# Altium project PCB_Project_MOPA_D.PrjPcb (part 2 of 2)

## Sheet [7] ADC_Acquisition.SchDoc: =DocumentName
size A3; Organization: ORGANIZATION; Address1: R. Aprígio Veloso, 882, Universitário; Address2: Campina Grande - PB; Address3: 58429-900; DocumentNumber: 7; Revision: -; SheetNumber: 7; SheetTotal: 8; Project: PCB_Project_MOPA_D.PrjPcb; ENG_DATE: --/--/--; DSN_DATE: --/--/--; CHK_DATE: --/--/--; SCH_SCALE: 1:1
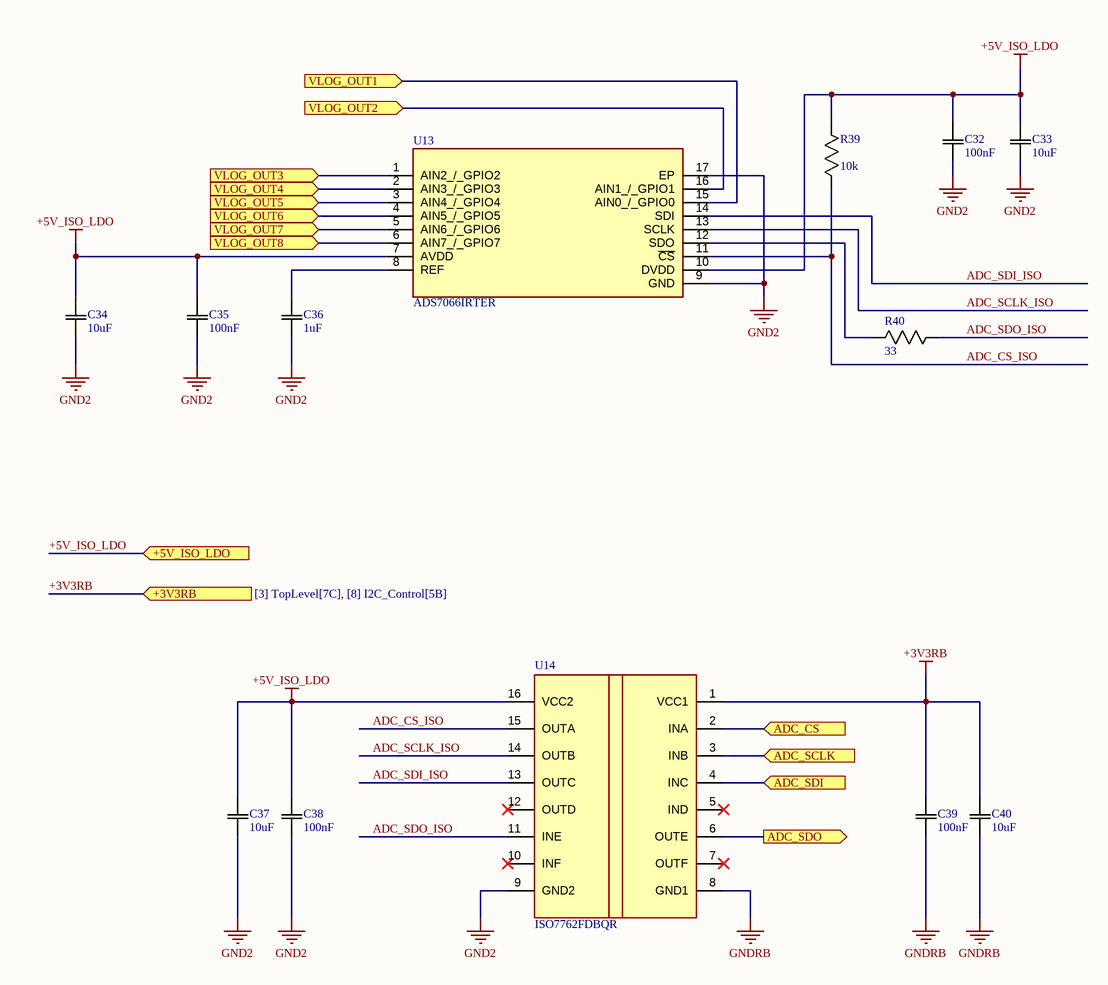
[diagram p7: [7] ADC_Acquisition.SchDoc]

### Parts
C32  value 100nF  [CAPC1005X40N]  (hidden comment: GCM155R71H104KE02D)
C33  value 10uF  [CAPC1005X40N]  (hidden comment: GRT155R61A106ME13D)
C34  value 10uF  [CAPC1005X40N]  (hidden comment: GRT155R61A106ME13D)
C35  value 100nF  [CAPC1005X40N]  (hidden comment: GCM155R71H104KE02D)
C36  value 1uF  [CAPC1005X40N]  (hidden comment: GRM155Z71A105KE01D)
C37  value 10uF  [CAPC1005X40N]  (hidden comment: GRT155R61A106ME13D)
C38  value 100nF  [CAPC1005X40N]  (hidden comment: GCM155R71H104KE02D)
C39  value 100nF  [CAPC1005X40N]  (hidden comment: GCM155R71H104KE02D)
C40  value 10uF  [CAPC1005X40N]  (hidden comment: GRT155R61A106ME13D)
R39  value 10k  [RESC1005X40N]  (hidden comment: RC0402FR-0710KL)
R40  value 33  [RESC1005X40N]  (hidden comment: RC0402FR-0733RL)
U13  ADS7066IRTER  [QFN50P300X300X80-17N-D]
U14  ISO7762FDBQR  [SOP64P600X175-16N]

### Ports
+3V3RB (in, see [3] TopLevel[7C], [8] I2C_Control[5B]), +5V_ISO_LDO (in, see [3] TopLevel[7B], [4] PowerManagement[7B]), ADC_CS (in, see [3] TopLevel[7C]), ADC_SCLK (in, see [3] TopLevel[7C]), ADC_SDI (in, see [3] TopLevel[7C]), ADC_SDO (out, see [3] TopLevel[7C]), VLOG_OUT1 (in, see [3] TopLevel[7B], [5] AnalogChannels_1_2_3_4[4A]), VLOG_OUT2 (in, see [3] TopLevel[7B], [5] AnalogChannels_1_2_3_4[8A]), VLOG_OUT3 (in, see [3] TopLevel[7B], [5] AnalogChannels_1_2_3_4[4C]), VLOG_OUT4 (in, see [3] TopLevel[7B], [5] AnalogChannels_1_2_3_4[8C]), VLOG_OUT5 (in, see [3] TopLevel[7C], [6] AnalogChannels_5_6_7_8[4A]), VLOG_OUT6 (in, see [3] TopLevel[7C], [6] AnalogChannels_5_6_7_8[8A]), VLOG_OUT7 (in, see [3] TopLevel[7C], [6] AnalogChannels_5_6_7_8[4C]), VLOG_OUT8 (in, see [3] TopLevel[7C], [6] AnalogChannels_5_6_7_8[8C])

### Nets
+3V3RB: C39.2 C40.2 U14.1(VCC1) ; port +3V3RB
+5V_ISO_LDO: C32.2 C33.2 C34.2 C35.2 C37.2 C38.2 R39.1 U13.7(AVDD) U13.10(DVDD) U14.16(VCC2) ; port +5V_ISO_LDO
GND2: C32.1 C33.1 C34.1 C35.1 C36.1 C37.1 C38.1 U13.9(GND) U13.17(EP) U14.9(GND2)
GNDRB: C39.1 C40.1 U14.8(GND1)
ADC_CS: U14.2(INA) ; port ADC_CS
ADC_CS_ISO: R39.2 U13.11(~{CS}) U14.15(OUTA)
ADC_SCLK: U14.3(INB) ; port ADC_SCLK
ADC_SCLK_ISO: U13.13(SCLK) U14.14(OUTB)
ADC_SDI: U14.4(INC) ; port ADC_SDI
ADC_SDI_ISO: U13.14(SDI) U14.13(OUTC)
ADC_SDO: U14.6(OUTE) ; port ADC_SDO
ADC_SDO_ISO: R40.1 U14.11(INE)
VLOG_OUT1: U13.15(AIN0_/_GPIO0) ; port VLOG_OUT1
VLOG_OUT2: U13.16(AIN1_/_GPIO1) ; port VLOG_OUT2
VLOG_OUT3: U13.1(AIN2_/_GPIO2) ; port VLOG_OUT3
VLOG_OUT4: U13.2(AIN3_/_GPIO3) ; port VLOG_OUT4
VLOG_OUT5: U13.3(AIN4_/_GPIO4) ; port VLOG_OUT5
VLOG_OUT6: U13.4(AIN5_/_GPIO5) ; port VLOG_OUT6
VLOG_OUT7: U13.5(AIN6_/_GPIO6) ; port VLOG_OUT7
VLOG_OUT8: U13.6(AIN7_/_GPIO7) ; port VLOG_OUT8
NetC36_2: C36.2 U13.8(REF)
NetR40_2: R40.2 U13.12(SDO)

Not connected (* = marked no-connect by the designer): U14 5(IND)* 7(OUTF)* 10(INF)* 12(OUTD)*

### Notes on the sheet
- REVISION
- DESCRIPTION
- DATE
- APPROVED
- ADDRESS
- PROJECT
- VERSION
- TITLE
- A3
- SIZE
- SCALE
- DOCUMENT NAME:
- DOCUMENT REVISION:
- OF
- SHEET:
- PROJECT REVISION:

### Library data of the parts
C32 C35 C38 C39 = GCM155R71H104KE02D: 0.1 µF ±10% 50V Ceramic Capacitor X7R 0402 (1005 Metric); Manufacturer_Name: Murata; Copyright: Copyright (C) 2026 Ultra Librarian. All rights reserved.; Manufacturer_Part_Number: GCM155R71H104KE02D; Supplier 1: DigiKey; Supplier Part Number 1: 490-10672-1-ND; Datasheet Link: https://search.murata.co.jp/Ceramy/image/img/A01X/G101/ENG/GCM155R71H104KE02-01.pdf
C33 C34 C37 C40 = GRT155R61A106ME13D: 10 µF ±20% 10V Ceramic Capacitor X5R 0402 (1005 Metric); Manufacturer_Name: Murata; Copyright: Copyright (C) 2026 Ultra Librarian. All rights reserved.; Manufacturer_Part_Number: GRT155R61A106ME13D; Supplier 1: DigiKey; Supplier Part Number 1: 490-GRT155R61A106ME13DCT-ND; Datasheet Link: https://search.murata.co.jp/Ceramy/image/img/A01X/G101/ENG/GRT155R61A106ME13-01A.pdf
C36 = GRM155Z71A105KE01D: 1 µF ±10% 10V Ceramic Capacitor X7R 0402 (1005 Metric); Manufacturer_Name: Murata; Copyright: Copyright (C) 2025 Ultra Librarian. All rights reserved.; Manufacturer_Part_Number: GRM155Z71A105KE01D; Supplier 1: DigiKey; Supplier Part Number 1: 490-GRM155Z71A105KE01DCT-ND
R39 = RC0402FR-0710KL: 10 kOhms ±1% 0.063W, 1/16W Chip Resistor 0402 (1005 Metric) Moisture Resistant Thick Film; Manufacturer_Name: Yageo; Copyright: Copyright (C) 2025 Ultra Librarian. All rights reserved.; Manufacturer_Part_Number: RC0402FR-0710KL; Supplier: Digikey; Supplier 1: DigiKey; Supplier Part Number 1: 311-10.0KLRCT-ND; Datasheet Link: https://yageogroup.com/content/datasheet/asset/file/PYU-RC_GROUP_51_ROHS_L
R40 = RC0402FR-0733RL: 33 Ohms ±1% 0.063W, 1/16W Chip Resistor 0402 (1005 Metric) Moisture Resistant Thick Film; Manufacturer_Name: Yageo; Copyright: Copyright (C) 2025 Ultra Librarian. All rights reserved.; Manufacturer_Part_Number: RC0402FR-0733RL; Supplier 1: DigiKey; Supplier Part Number 1: 311-33.0LRCT-ND; Datasheet Link: https://yageogroup.com/content/datasheet/asset/file/PYU-RC_GROUP_51_ROHS_L
U13 = ADS7066IRTER: Analog to Digital Converters - ADC Eight-channel, 250-kSPS, 16-bit analog-to-digital converter with internal reference, GPIOs and SPI 16-WQFN -40 to 125; Manufacturer_Name: Texas Instruments; Geometry.Height: 0.8mm; Manufacturer_Part_Number: ADS7066IRTER; Mouser Part Number: 595-ADS7066IRTER; Mouser Price/Stock: https://www.mouser.co.uk/ProductDetail/Texas-Instruments/ADS7066IRTER?qs=ST9lo4GX8V1NXvZuWWBhPA%3D%3D; Arrow Part Number: ADS7066IRTER; Arrow Price/Stock: https://www.arrow.com/en/products/ads7066irter/texas-instruments.html?utm_currency=USD&region=nac; Datasheet Link: https://www.ti.com/lit/ds/symlink/ads7066.pdf?ts=1708383444470&ref_url=https%253A%252F%252Fwww.ti.com%252Fproduct%252FADS7066%253Futm_source%253Dgoogle%2526utm_medium%253Dcpc%2526utm_campaign%253Dasc-null-null-GPN_EN-cpc-pf-google-wwe%2526utm_content%253D; Supplier 1: Digikey; Supplier Part Number 1: 296-ADS7066IRTERCT-ND; Value: ADS7066IRTER
U14 = ISO7762FDBQR: General Purpose Digital Isolator 3000Vrms 6 Channel 100Mbps 85kV/µs CMTI 16-SSOP (0.154", 3.90mm Width); Manufacturer_Name: Texas Instruments; TYPE: TYPE; RefDes: RefDes; Copyright: Copyright (C) 2025 Ultra Librarian. All rights reserved.; Manufacturer_Part_Number: ISO7762FDBQR; Supplier 1: DigiKey; Supplier Part Number 1: 296-49452-1-ND; Value: ISO7762FDBQR; Datasheet Link: https://www.ti.com/lit/ds/symlink/iso7760.pdf?ts=1712058534565&ref_url=https%253A%252F%252Fwww.ti.com%252Fsitesearch%252Fen-us%252Fdocs%252Funiversalsearch.tsp%253FlangPref%253Den-US%2526searchTerm%253DISO7760DBQR%2526nr%253D9

## Nets that join several sheets
+3V3_ISO: [5] AnalogChannels_1_2_3_4 (8 pins), [6] AnalogChannels_5_6_7_8 (8 pins), [4] PowerManagement (C14.2 R5.1 U4.5), [8] I2C_Control (9 pins)
+3V3RB: [3] TopLevel (CN2.1 CN2.17), [8] I2C_Control (5 pins), [7] ADC_Acquisition (C39.2 C40.2 U14.1)
+5V_ISO: [5] AnalogChannels_1_2_3_4 (L1.1 L2.1 L3.1 L4.1), [6] AnalogChannels_5_6_7_8 (L5.1 L6.1 L7.1 L8.1), [4] PowerManagement (9 pins)
+5V_ISO_LDO: [4] PowerManagement (C12.2 C13.2 U3.1 U3.2), [7] ADC_Acquisition (10 pins)
GND2: [5] AnalogChannels_1_2_3_4 (24 pins), [6] AnalogChannels_5_6_7_8 (24 pins), [4] PowerManagement (15 pins), [8] I2C_Control (9 pins), [7] ADC_Acquisition (10 pins)
GNDRB: [3] TopLevel (8 pins), [8] I2C_Control (C44.1 C45.1 U16.5), [7] ADC_Acquisition (C39.1 C40.1 U14.8)
ADC_CS: [3] TopLevel (CN2.24), [7] ADC_Acquisition (U14.2)
ADC_SCLK: [3] TopLevel (R47.2), [7] ADC_Acquisition (U14.3)
ADC_SDI: [3] TopLevel (R46.2), [7] ADC_Acquisition (U14.4)
ADC_SDO: [3] TopLevel (CN2.21), [7] ADC_Acquisition (U14.6)
NetR7_2: [5] AnalogChannels_1_2_3_4 (R7.2 U5.6), [8] I2C_Control (U15.7)
NetR8_2: [5] AnalogChannels_1_2_3_4 (R8.2 U5.5), [8] I2C_Control (U15.6)
NetR9_2: [5] AnalogChannels_1_2_3_4 (R9.2 U6.6), [8] I2C_Control (U15.5)
NetR10_2: [5] AnalogChannels_1_2_3_4 (R10.2 U6.5), [8] I2C_Control (U15.4)
NetR15_2: [5] AnalogChannels_1_2_3_4 (R15.2 U7.6), [8] I2C_Control (U15.11)
NetR16_2: [5] AnalogChannels_1_2_3_4 (R16.2 U7.5), [8] I2C_Control (U15.10)
NetR17_2: [5] AnalogChannels_1_2_3_4 (R17.2 U8.6), [8] I2C_Control (U15.9)
NetR18_2: [5] AnalogChannels_1_2_3_4 (R18.2 U8.5), [8] I2C_Control (U15.8)
NetR23_2: [6] AnalogChannels_5_6_7_8 (R23.2 U9.6), [8] I2C_Control (U15.14)
NetR24_2: [6] AnalogChannels_5_6_7_8 (R24.2 U9.5), [8] I2C_Control (U15.13)
NetR25_2: [6] AnalogChannels_5_6_7_8 (R25.2 U10.6), [8] I2C_Control (U15.16)
NetR26_2: [6] AnalogChannels_5_6_7_8 (R26.2 U10.5), [8] I2C_Control (U15.15)
NetR31_2: [6] AnalogChannels_5_6_7_8 (R31.2 U11.6), [8] I2C_Control (U15.20)
NetR32_2: [6] AnalogChannels_5_6_7_8 (R32.2 U11.5), [8] I2C_Control (U15.19)
NetR33_2: [6] AnalogChannels_5_6_7_8 (R33.2 U12.6), [8] I2C_Control (U15.18)
NetR34_2: [6] AnalogChannels_5_6_7_8 (R34.2 U12.5), [8] I2C_Control (U15.17)
PCA_SCL: [3] TopLevel (CN2.5), [8] I2C_Control (R45.2 U16.6)
PCA_SDA: [3] TopLevel (CN2.3), [8] I2C_Control (R44.2 U16.7)
VLOG_OUT1: [5] AnalogChannels_1_2_3_4 (R12.1 U6.10), [7] ADC_Acquisition (U13.15)
VLOG_OUT2: [5] AnalogChannels_1_2_3_4 (R11.1 U5.10), [7] ADC_Acquisition (U13.16)
VLOG_OUT3: [5] AnalogChannels_1_2_3_4 (R20.1 U8.10), [7] ADC_Acquisition (U13.1)
VLOG_OUT4: [5] AnalogChannels_1_2_3_4 (R19.1 U7.10), [7] ADC_Acquisition (U13.2)
VLOG_OUT5: [6] AnalogChannels_5_6_7_8 (R27.1 U9.10), [7] ADC_Acquisition (U13.3)
VLOG_OUT6: [6] AnalogChannels_5_6_7_8 (R28.1 U10.10), [7] ADC_Acquisition (U13.4)
VLOG_OUT7: [6] AnalogChannels_5_6_7_8 (R36.1 U12.10), [7] ADC_Acquisition (U13.5)
VLOG_OUT8: [6] AnalogChannels_5_6_7_8 (R35.1 U11.10), [7] ADC_Acquisition (U13.6)

## Assembly variants
Fabricação: all parts fitted